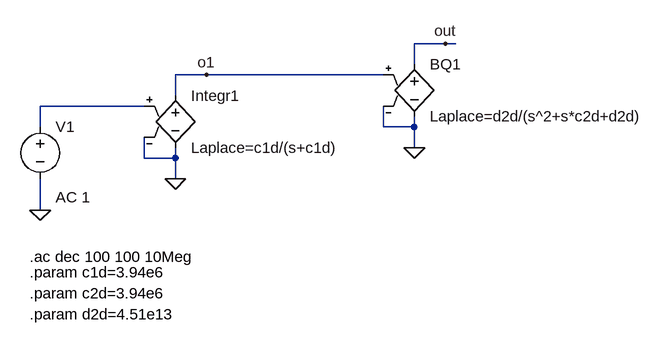
[diagram p0: schematic Laplace_fdt_3rd_order.asc]
Laplace_fdt_3rd_order.asc, the LTspice schematic file:
Version 4
SHEET 1 2564 1736
WIRE 1856 368 1808 368
WIRE 1872 368 1856 368
WIRE 1808 400 1808 368
WIRE 1488 416 1440 416
WIRE 1760 416 1488 416
WIRE 1440 448 1440 416
WIRE 1392 464 1232 464
WIRE 1232 496 1232 464
WIRE 1760 496 1760 464
WIRE 1808 496 1808 480
WIRE 1808 496 1760 496
WIRE 1808 528 1808 496
WIRE 1392 544 1392 512
WIRE 1440 544 1440 528
WIRE 1440 544 1392 544
WIRE 1440 576 1440 544
WIRE 1232 624 1232 576
FLAG 1232 624 0
FLAG 1440 576 0
FLAG 1488 416 o1
FLAG 1808 528 0
FLAG 1856 368 out
SYMBOL voltage 1232 480 R0
WINDOW 123 24 124 Left 2
WINDOW 39 0 0 Left 0
SYMATTR Value2 AC 1
SYMATTR InstName V1
SYMATTR Value ""
SYMBOL e 1440 432 R0
SYMATTR InstName Integr1
SYMATTR Value Laplace=c1d/(s+c1d)
SYMBOL e 1808 384 R0
SYMATTR InstName BQ1
SYMATTR Value Laplace=d2d/(s^2+s*c2d+d2d)
TEXT 1216 696 Left 2 !.ac dec 100 100 10Meg
TEXT 1216 720 Left 2 !.param c1d=3.94e6
TEXT 1216 752 Left 2 !.param c2d=3.94e6
TEXT 1216 784 Left 2 !.param d2d=4.51e13

The netlist it stands for:
* Laplace_fdt_3rd_order.asc
V1 N001 0 AC 1
E§Integr1 o1 0 N001 0 Laplace=c1d/(s+c1d)
E§BQ1 out 0 o1 0 Laplace=d2d/(s^2+s*c2d+d2d)
.ac dec 100 100 10Meg
.param c1d=3.94e6
.param c2d=3.94e6
.param d2d=4.51e13
.backanno
.end